# EAGLE design Motor board (EAGLE 9.4.1)
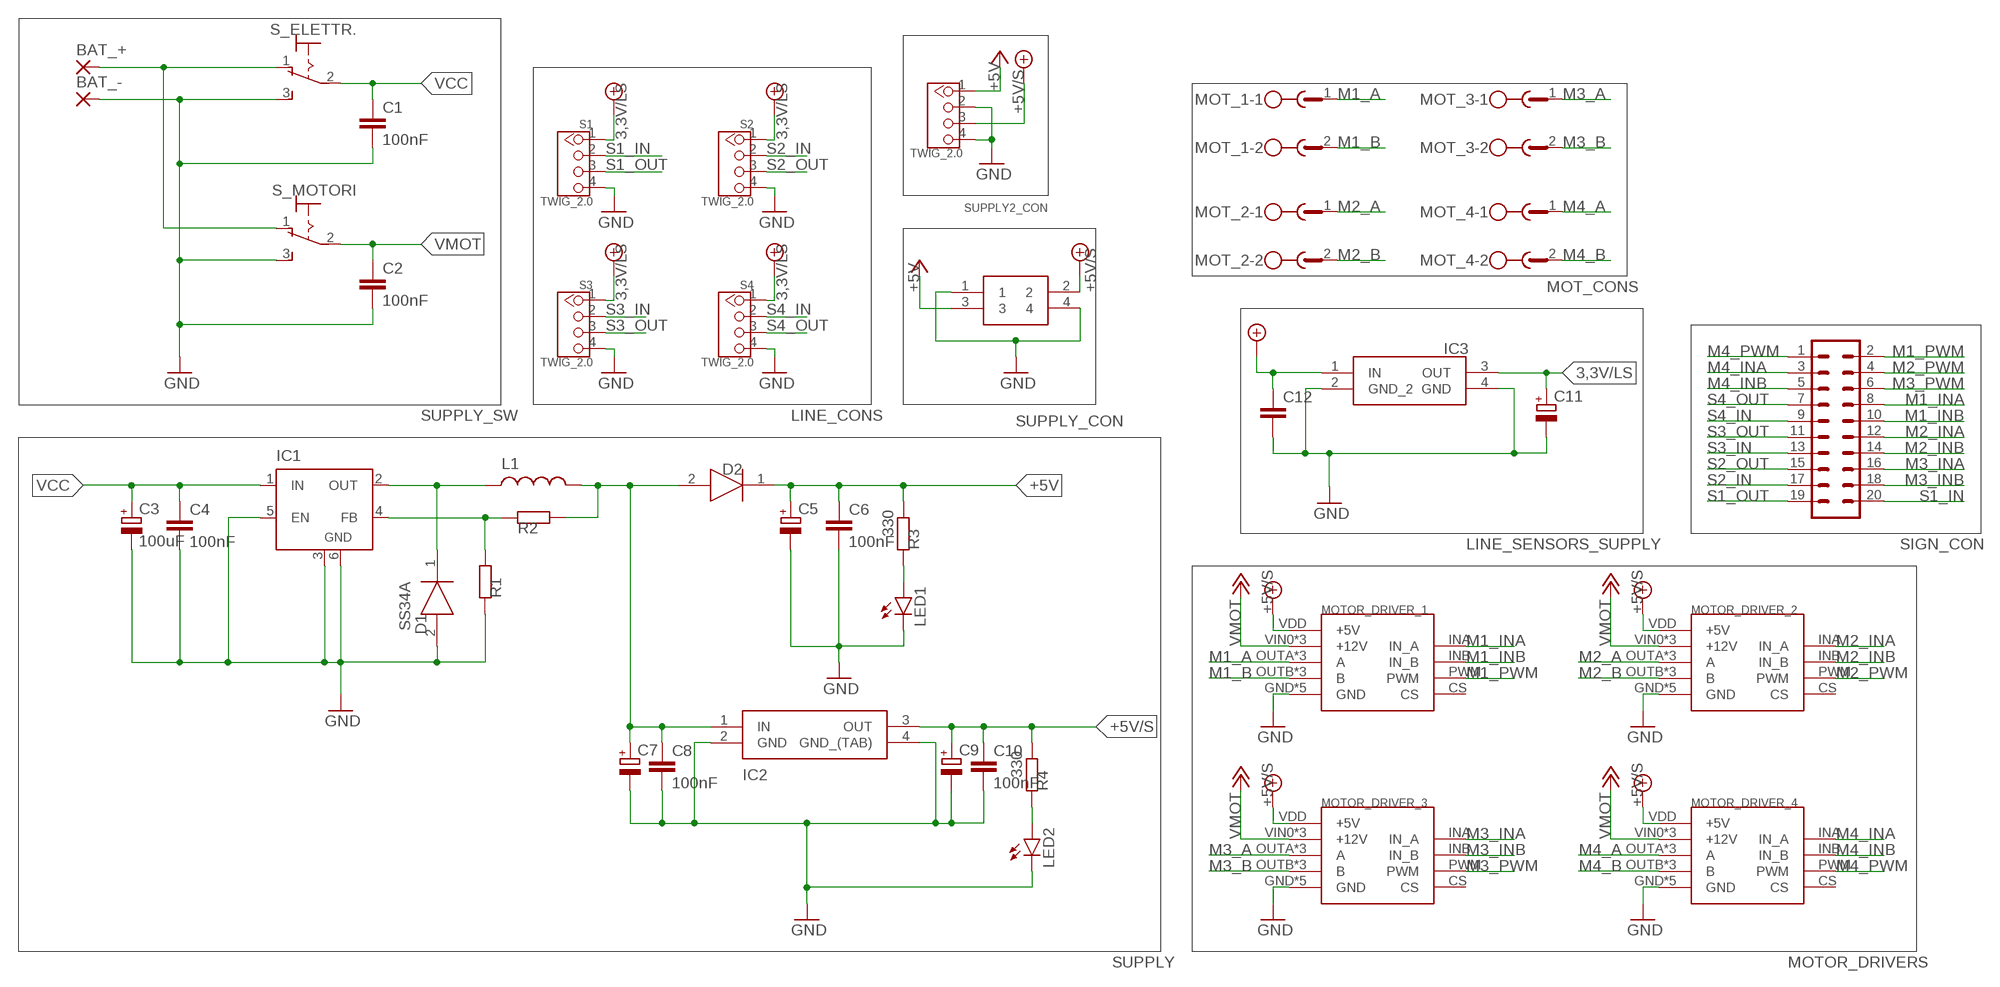
[diagram p0: schematic, sheet 1]

## Parts
BAT_+  3,81/1,4  [3,81/1,4]
BAT_-  3,81/1,4  [3,81/1,4]
C1  100nF  C-EUC1206  [C1206]
C2  100nF  C-EUC1206  [C1206]
C3  100uF  CPOL-EUCT7343  [CT7343]
C4  100nF  C-EUC1206  [C1206]
C5  CPOL-EUE  [PANASONIC_E]
C6  100nF  C-EUC1206  [C1206]
C7  CPOL-EUE  [PANASONIC_E]
C8  100nF  C-EUC1206  [C1206]
C9  CPOL-EUE  [PANASONIC_E]
C10  100nF  C-EUC1206  [C1206]
C11  CPOL-EUE  [PANASONIC_E]
C12  100nF  C-EUC1206  [C1206]
D1  SS34A  [DIOM5026X262N]
D2  SE20FG-M3_H  [SODFL3718X108N]
IC1  LM2596S  [TO263-5]
IC2  LM2940CS-5.0_NOPB  [TO254P1435X464-4N]
IC3  LM3940IS-3.3  [TO254P1435X457-4N]
L1  47uH  MSS1260  [MSS1260]
LED1  LEDSML1206  [SML1206]
LED2  LEDSML1206  [SML1206]
MOT_1  MST2V  [MSTBV2]
MOT_2  MST2V  [MSTBV2]
MOT_3  MST2V  [MSTBV2]
MOT_4  MST2V  [MSTBV2]
MOTOR_DRIVER_1  VNH5019  [VNH5019]
MOTOR_DRIVER_2  VNH5019  [VNH5019]
MOTOR_DRIVER_3  VNH5019  [VNH5019]
MOTOR_DRIVER_4  VNH5019  [VNH5019]
R1  330  R-EU_R1206  [R1206]
R2  1,2k  R-EU_R1206  [R1206]
R3  330  R-EU_R1206  [R1206]
R4  330  R-EU_R1206  [R1206]
S1  TWIG_2.0  [2.0_1X4]
S2  TWIG_2.0  [2.0_1X4]
S3  TWIG_2.0  [2.0_1X4]
S4  TWIG_2.0  [2.0_1X4]
S_ELETTR.  320-916  [320-916]
S_MOTORI  320-916  [320-916]
SIGN_CON  20V  [20V]
SUPPLY2_CON  TWIG_2.0  [2.0_1X4]
SUPPLY_CON  39-28-1043  [39-28-1043]

## Nets
3,3V/LS: C11.+ IC3.3(OUT) S1.1 S2.1 S3.1 S4.1 ; supply symbol labelled +5V/1
5.7V-DIRAMAZIONE2: C7.+ C8.1 D2.2(A) IC2.1(IN) L1.P$1 R2.1
+5V: C5.+ C6.1 D2.1(K) R3.1 SUPPLY2_CON.1 SUPPLY_CON.3
+5V/S: C9.+ C10.1 C12.1 IC2.3(OUT) IC3.1(IN) MOTOR_DRIVER_1.VDD(+5V) MOTOR_DRIVER_2.VDD(+5V) MOTOR_DRIVER_3.VDD(+5V) MOTOR_DRIVER_4.VDD(+5V) R4.1 SUPPLY2_CON.3 SUPPLY_CON.2 ; supply symbol labelled +5V/1
GND [Power]: BAT_-.1(P) C1.2 C2.2 C3.- C4.2 C5.- C6.2 C7.- C8.2 C9.- C10.2 C11.- C12.2 D1.2(A) IC1.3(GND) IC1.5(EN) IC1.6(GND) IC2.2(GND) IC2.4(GND_(TAB)) IC3.2(GND_2) IC3.4(GND) LED1.C LED2.C MOTOR_DRIVER_1.GND MOTOR_DRIVER_1.GND0(GND) MOTOR_DRIVER_1.GND1(GND) MOTOR_DRIVER_1.GND2(GND) MOTOR_DRIVER_1.GND3(GND) MOTOR_DRIVER_2.GND MOTOR_DRIVER_2.GND0(GND) MOTOR_DRIVER_2.GND1(GND) MOTOR_DRIVER_2.GND2(GND) MOTOR_DRIVER_2.GND3(GND) MOTOR_DRIVER_3.GND MOTOR_DRIVER_3.GND0(GND) MOTOR_DRIVER_3.GND1(GND) MOTOR_DRIVER_3.GND2(GND) MOTOR_DRIVER_3.GND3(GND) MOTOR_DRIVER_4.GND MOTOR_DRIVER_4.GND0(GND) MOTOR_DRIVER_4.GND1(GND) MOTOR_DRIVER_4.GND2(GND) MOTOR_DRIVER_4.GND3(GND) R1.1 S1.4 S2.4 S3.4 S4.4 S_ELETTR..3(S) S_MOTORI.3(S) SUPPLY2_CON.2 SUPPLY2_CON.4 SUPPLY_CON.1 SUPPLY_CON.4
M1_A: MOT_1.1 MOTOR_DRIVER_1.OUTA2(A) MOTOR_DRIVER_1.OUTA3(A) MOTOR_DRIVER_1.OUTA(A)
M1_B: MOT_1.2 MOTOR_DRIVER_1.OUTB1(B) MOTOR_DRIVER_1.OUTB3(B) MOTOR_DRIVER_1.OUTB(B)
M1_INA: MOTOR_DRIVER_1.INA(IN_A) SIGN_CON.8
M1_INB: MOTOR_DRIVER_1.INB(IN_B) SIGN_CON.10
M1_PWM: MOTOR_DRIVER_1.PWM SIGN_CON.2
M2_A: MOT_2.1 MOTOR_DRIVER_2.OUTA2(A) MOTOR_DRIVER_2.OUTA3(A) MOTOR_DRIVER_2.OUTA(A)
M2_B: MOT_2.2 MOTOR_DRIVER_2.OUTB1(B) MOTOR_DRIVER_2.OUTB3(B) MOTOR_DRIVER_2.OUTB(B)
M2_INA: MOTOR_DRIVER_2.INA(IN_A) SIGN_CON.12
M2_INB: MOTOR_DRIVER_2.INB(IN_B) SIGN_CON.14
M2_PWM: MOTOR_DRIVER_2.PWM SIGN_CON.4
M3_A: MOT_3.1 MOTOR_DRIVER_3.OUTA2(A) MOTOR_DRIVER_3.OUTA3(A) MOTOR_DRIVER_3.OUTA(A)
M3_B: MOT_3.2 MOTOR_DRIVER_3.OUTB1(B) MOTOR_DRIVER_3.OUTB3(B) MOTOR_DRIVER_3.OUTB(B)
M3_INA: MOTOR_DRIVER_3.INA(IN_A) SIGN_CON.16
M3_INB: MOTOR_DRIVER_3.INB(IN_B) SIGN_CON.18
M3_PWM: MOTOR_DRIVER_3.PWM SIGN_CON.6
M4_A: MOT_4.1 MOTOR_DRIVER_4.OUTA2(A) MOTOR_DRIVER_4.OUTA3(A) MOTOR_DRIVER_4.OUTA(A)
M4_B: MOT_4.2 MOTOR_DRIVER_4.OUTB1(B) MOTOR_DRIVER_4.OUTB3(B) MOTOR_DRIVER_4.OUTB(B)
M4_INA: MOTOR_DRIVER_4.INA(IN_A) SIGN_CON.3
M4_INB: MOTOR_DRIVER_4.INB(IN_B) SIGN_CON.5
M4_PWM: MOTOR_DRIVER_4.PWM SIGN_CON.1
N$1 [Power]: BAT_+.1(P) S_ELETTR..1(O) S_MOTORI.1(O)
N$2: LED2.A R4.2
N$3: LED1.A R3.2
N$6: D1.1(K) IC1.2(OUT) L1.P$2
N$7: IC1.4(FB) R1.2 R2.2
S1_IN: S1.2 SIGN_CON.20
S1_OUT: S1.3 SIGN_CON.19
S2_IN: S2.2 SIGN_CON.17
S2_OUT: S2.3 SIGN_CON.15
S3_IN: S3.2 SIGN_CON.13
S3_OUT: S3.3 SIGN_CON.11
S4_IN: S4.2 SIGN_CON.9
S4_OUT: S4.3 SIGN_CON.7
VCC: C1.1 C3.+ C4.1 IC1.1(IN) S_ELETTR..2(P)
VMOT [Power]: C2.1 MOTOR_DRIVER_1.VIN0(+12V) MOTOR_DRIVER_1.VIN1(+12V) MOTOR_DRIVER_1.VIN2(+12V) MOTOR_DRIVER_2.VIN0(+12V) MOTOR_DRIVER_2.VIN1(+12V) MOTOR_DRIVER_2.VIN2(+12V) MOTOR_DRIVER_3.VIN0(+12V) MOTOR_DRIVER_3.VIN1(+12V) MOTOR_DRIVER_3.VIN2(+12V) MOTOR_DRIVER_4.VIN0(+12V) MOTOR_DRIVER_4.VIN1(+12V) MOTOR_DRIVER_4.VIN2(+12V) S_MOTORI.2(P) ; supply symbol labelled +12V
Unconnected: MOTOR_DRIVER_1.CS MOTOR_DRIVER_2.CS MOTOR_DRIVER_3.CS MOTOR_DRIVER_4.CS

## Notes on the sheet
- MOT_CONS
- SUPPLY_SW | LINE_CONS
- LINE_SENSORS_SUPPLY
- SUPPLY | MOTOR_DRIVERS

## Library data of the parts
BAT_+ BAT_- = wirepad:3,81/1,4: THROUGH-HOLE PAD
C1 C2 C4 C6 C8 C10 C12 = rcl:C-EU: CAPACITOR, European symbol; SPICEPREFIX: C
C3 C5 C7 C9 C11 = rcl:CPOL-EU: POLARIZED CAPACITOR, European symbol; SPICEPREFIX: C
D1 = SamacSys_Parts:SS34A: HY Electronic Corp SS34A, SMT Rectifier Schottky Diode, 40V 3A, 2-Pin SMA Source: Datasheet <http://uk.rs-online.com/web/p/products/1711454>; DESCRIPTION: HY Electronic Corp SS34A, SMT Rectifier Schottky Diode, 40V 3A, 2-Pin SMA; HEIGHT: 2.62mm; MANUFACTURER_NAME: HY Electronic Corp; MANUFACTURER_PART_NUMBER: SS34A; RS_PART_NUMBER: 1711454
D2 = SE20FG-M3_H:SE20FG-M3_H: Diode Rectifier 2A 400V Standard DO219AB Vishay SE20FG-M3/H, SMT Diode, 400V 2A, 920ns, 2-Pin DO-219AB Source: Datasheet <http://uk.rs-online.com/web/p/products/8949262P>; DESCRIPTION: Diode Rectifier 2A 400V Standard DO219AB Vishay SE20FG-M3/H, SMT Diode, 400V 2A, 920ns, 2-Pin DO-219AB; HEIGHT: 1.08mm; MANUFACTURER_NAME: Vishay; MANUFACTURER_PART_NUMBER: SE20FG-M3/H; RS_PART_NUMBER: 8949262P
IC1 = linear:LM2596S: STEP-DOWN VOLTAGE REGULATOR
IC2 = LM2940CS-5.0_NOPB:LM2940CS-5.0_NOPB: 1A,5V,LDO Voltage Regulator,LM2940CS-5.0 Source: Datasheet <http://www.ti.com/lit/ds/symlink/lm2940c.pdf>; DESCRIPTION: 1A,5V,LDO Voltage Regulator,LM2940CS-5.0; HEIGHT: 4.64mm; MANUFACTURER_NAME: Texas Instruments; MANUFACTURER_PART_NUMBER: LM2940CS-5.0/NOPB; MOUSER_PART_NUMBER: 926-LM2940CS-5.0NOPB; MOUSER_PRICE-STOCK: https://www.mouser.com/Search/Refine.aspx?Keyword=926-LM2940CS-5.0NOPB; RS_PART_NUMBER: 2508123693; RS_PRICE-STOCK: http://uk.rs-online.com/web/p/products/2508123693
IC3 = LM3940IS-3.3:LM3940IS-3.3: Low Dropout Regulator Source: Datasheet; DESCRIPTION: Low Dropout Regulator; HEIGHT: mm; MANUFACTURER_NAME: Texas Instruments; MANUFACTURER_PART_NUMBER: LM3940IS-3.3; MOUSER_PART_NUMBER: 926-LM3940IS-33; MOUSER_PRICE-STOCK: https://www.mouser.com/Search/Refine.aspx?Keyword=926-LM3940IS-33; RS_PART_NUMBER: 3461773; RS_PRICE-STOCK: http://uk.rs-online.com/web/p/products/3461773
L1 = inductor-coilcraft:MSS1260: SMT Power Inductor
LED1 LED2 = led:LED: LED OSRAM: - CHIPLED LG R971, LG N971, LY N971, LG Q971, LY Q971, LO R971, LY R971 LH N974, LH R974 LS Q976, LO Q976, LY Q976 LO Q996 - Hyper CHIPLED LW Q18S LB Q993, LB Q99A, LB R99A - SideLED LS A670, LO A670, LY A670, LG A670, LP A670 LB A673, LV A673, LT A673, LW A673 LH A674 LY A675 LS A676, LA A676, LO A676, LY A676, LW A676 LS A679, LY A679, LG A679 - Hyper Micro SIDELED® LS Y876, LA Y876, LO Y876, LY Y876 LT Y87S - SmartLED LW L88C, LW L88S LB L89C, LB L89S, LG L890 LS L89K, LO L89K, LY L89K LS L896, LA L896, LO L896, LY L896 - TOPLED LS T670, LO T670, LY T670, LG T670, LP T670 LSG T670, LSP T670, LSY T670, LOP T670, LYG T670 LG T671, LOG T671, LSG T671 LB T673, LV T673, LT T673, LW T673 LH T674 LS T676, LA T676, LO T676, LY T676, LB T676, LH T676, LSB T676, LW T676 LB T67C, LV T67C, LT T67C, LS T67K, LO T67K, LY T67K, LW E67C LS E67B, LA E67B, LO E67B, LY E67B, LB E67C, LV E67C, LT E67C LW T67C LS T679, LY T679, LG T679 LS T770, LO T770, LY T770, LG T770, LP T770 LB T773, LV T773, LT T773, LW T773 LH T774 LS E675, LA E675, LY E675, LS T675 LS T776, LA T776, LO T776, LY T776, LB T776 LHGB T686 LT T68C, LB T68C - Hyper Mini TOPLED® LB M676 - Mini TOPLED Santana® LG M470 LS M47K, LO M47K, LY M47K Source: http://www.osram.convergy.de LUXEON: - LUMILED® LXK2-PW12-R00, LXK2-PW12-S00, LXK2-PW14-U00, LXK2-PW14-V00 LXK2-PM12-R00, LXK2-PM12-S00, LXK2-PM14-U00 LXK2-PE12-Q00, LXK2-PE12-R00, LXK2-PE12-S00, LXK2-PE14-T00, LXK2-PE14-U00 LXK2-PB12-K00, LXK2-PB12-L00, LXK2-PB12-M00, LXK2-PB14-N00, LXK2-PB14-P00, LXK2-PB14-Q00 LXK2-PR12-L00, LXK2-PR12-M00, LXK2-PR14-Q00, LXK2-PR14-R00 LXK2-PD12-Q00, LXK2-PD12-R00, LXK2-PD12-S00 LXK2-PH12-R00, LXK2-PH12-S00 LXK2-PL12-P00, LXK2-PL12-Q00, LXK2-PL12-R00 Source: www.luxeon.com KINGBRIGHT: KA-3528ASYC Source: www.kingbright.com
MOT_1-MOT_4 = con-phoenix-508:MST2V: PHOENIX; OC_FARNELL: unknown; OC_NEWARK: unknown
MOTOR_DRIVER_1-MOTOR_DRIVER_4 = DRIVER POLOLU:VNH5019: aggiornato il 24/10/14 con pin cs (AD)
R1-R4 = rcl:R-EU_: RESISTOR, European symbol; SPICEPREFIX: R
S1-S4 SUPPLY2_CON = CONNECTER:TWIG_2.0
S_ELETTR. S_MOTORI = switch:320-916: TOGGLE SWITCH distributor RS Components
SIGN_CON = con-harting-v-edit:20V: CONNECTOR; OC_FARNELL: unknown; OC_NEWARK: unknown
SUPPLY_CON = 39-28-1043:39-28-1043: Mini-Fit Jr. Vertical Header, 4.20mm Pitch, Dual Row, 4 Circuits, without Snap-in Plastic Peg PCB Lock, Tin, Natural Source: Datasheet <http://docs-emea.rs-online.com/webdocs/0460/0900766b80460da1.pdf>; DESCRIPTION: Mini-Fit Jr. Vertical Header, 4.20mm Pitch, Dual Row, 4 Circuits, without Snap-in Plastic Peg PCB Lock, Tin, Natural; HEIGHT: mm; MANUFACTURER_NAME: Molex; MANUFACTURER_PART_NUMBER: 39-28-1043; MOUSER_PART_NUMBER: 538-39-28-1043; MOUSER_PRICE-STOCK: https://www.mouser.com/Search/Refine.aspx?Keyword=538-39-28-1043; RS_PART_NUMBER: 4841899P; RS_PRICE-STOCK: http://uk.rs-online.com/web/p/products/4841899P

## Net classes
1 Power: width 0.508 mm, clearance 0.508 mm

## Board
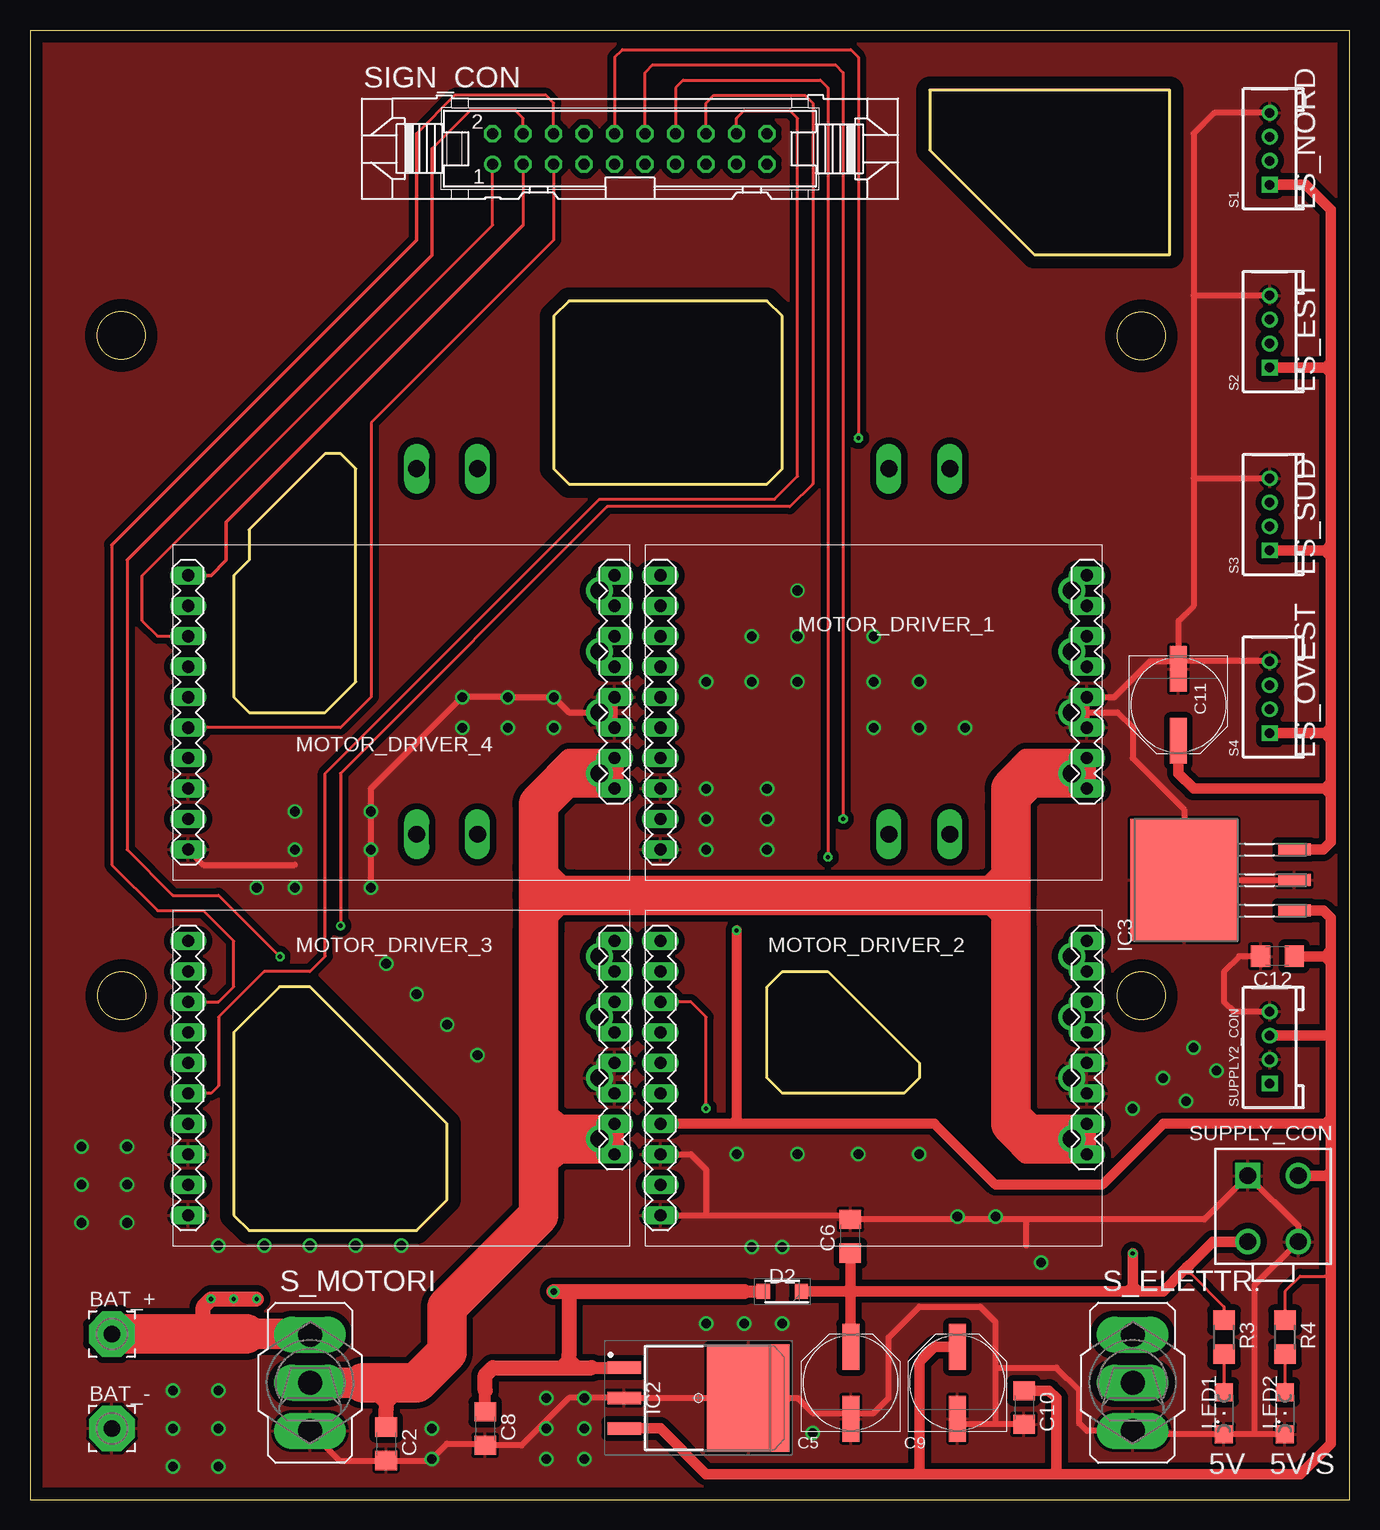
[diagram p1: board, top side]
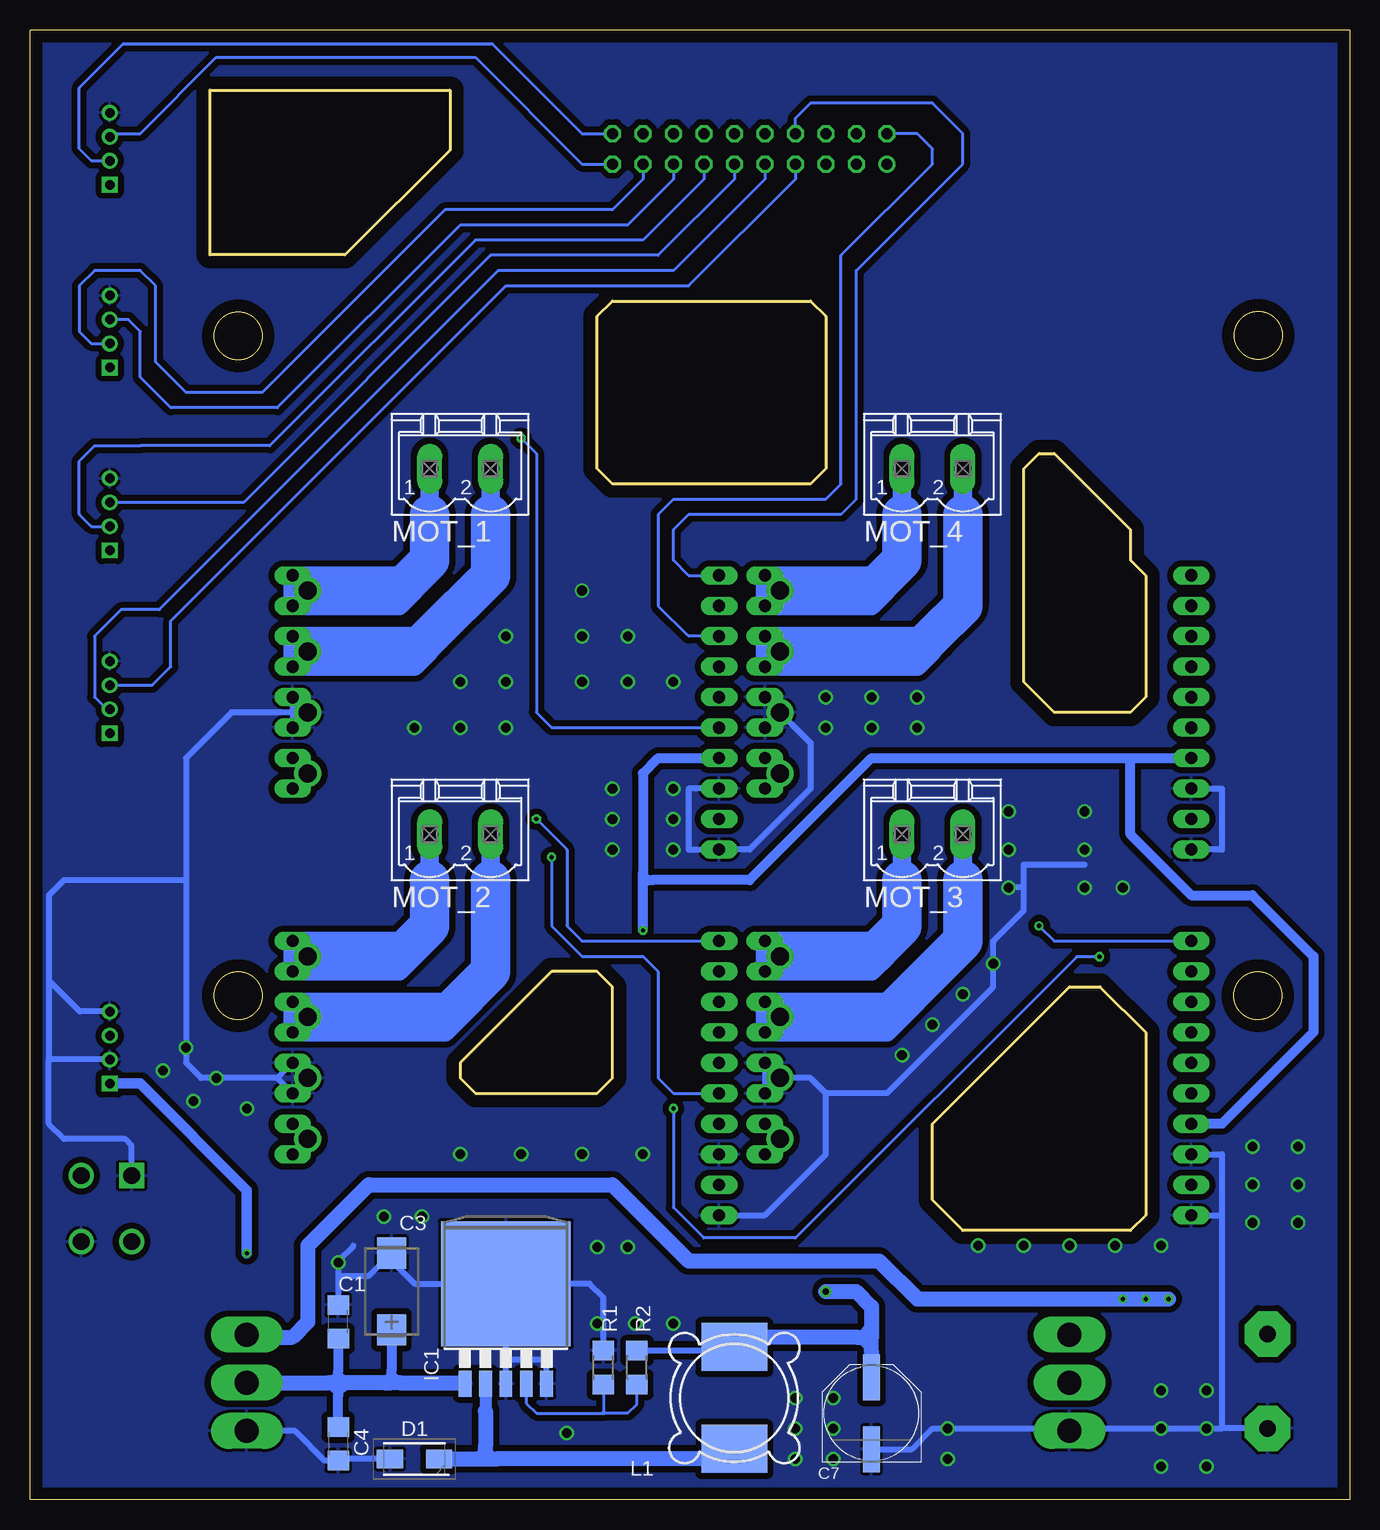
[diagram p2: board, bottom side, seen from below]

Size 110 x 122.5 mm. Coordinates in mm from the lower left corner, seen from the top.
Outline: 110,0 110,122.5 0,122.5 0,0 110,0
Outline: 75,112.5 83.73,103.77 95,103.77 95,117.5 75,117.5 75,112.5
Outline: 43.66,85.93 44.93,84.66 61.44,84.66 62.71,85.93 62.71,98.63 61.44,99.9 44.93,99.9 43.66,98.63 43.66,85.93
Outline: 16.99,38.94 16.99,23.7 18.26,22.43 32.23,22.43 34.77,24.97 34.77,31.32 23.34,42.75 20.8,42.75 16.99,38.94
Outline: 61.44,42.75 62.71,44.02 66.52,44.02 74.14,36.4 74.14,35.13 72.87,33.86 62.71,33.86 61.44,35.13 61.44,42.75
Outline: 18.26,65.61 24.61,65.61 27.15,68.15 27.15,85.93 25.88,87.2 24.61,87.2 18.26,80.85 18.26,78.31 16.99,77.04 16.99,66.88 18.26,65.61
Outline: circle at 7.64,42.01 radius 2
Outline: circle at 7.6,97.05 radius 2
Outline: circle at 92.64,97.01 radius 2
Outline: circle at 92.64,42.01 radius 2
Copper layers (1*16): Top 0.035mm / dielectric 1.5mm / Bottom 0.035mm
Design rules "default *": minimum track width 6mil, minimum drill 0.35mm, track to track 5mil, track to pad 7mil, pad to pad 10mil, via to via 10mil, smd to smd 6mil, copper to edge 40mil, drill to drill 6mil, minimum pad ring 10mil, minimum via ring 8mil, stop-mask expansion 4mil, vias tented up to drill 0mil, thermal gap 10mil

### Footprints (pad centres in the part's own frame; a part is rotated, then mirrored left to right if it is on the bottom)
3,81/1,4 = drill 1.397 pad 3.81 octagon: 1 0,0
C1206 = smd 1.6 x 1.8: 1 -1.4,0; 2 1.4,0
CT7343 = smd 2.6 x 2.4: + -3.2,0; - 3.2,0
PANASONIC_E = smd 3.8 x 1.4: + 3,0; - -3,0
DIOM5026X262N = smd 2.2 x 1.55: 1 -2.05,0; 2 2.05,0
SODFL3718X108N = smd 1.12 x 1.22: 1 -1.6,0; 2 1.6,0
TO263-5 = smd 1.067 x 2.159: 1 -3.404,-5.791; 2 -1.702,-5.791; 3 0,-5.791; 4 1.702,-5.791; 5 3.404,-5.791 | smd 10.8 x 10.41: 6 0,2.54
TO254P1435X464-4N = smd 2.8 x 1.05: 1 -6.2,2.54; 2 -6.2,0; 3 -6.2,-2.54 | smd 6.85 x 8.95: 4 4.15,0
TO254P1435X457-4N = smd 1.016 x 2.692: 1 -2.54,-9.042; 2 0,-9.042; 3 2.54,-9.042 | smd 10.16 x 8.941: 4 0,0.152
MSS1260 = smd 5.5 x 4: P$1 0,4.25; P$2 0,-4.25
SML1206 = smd 1.5 x 1.5: A 1.75,0; C -1.75,0
MSTBV2 = drill 1.397 long: 1 -2.54,0; 2 2.54,0
VNH5019 = drill 1.016 long: CS 1.27,17.78; ENA 1.27,22.86; ENB 1.27,15.24; GND 1.27,7.62; GND0 36.83,12.7; GND1 1.27,2.54; GND2 36.83,15.24; INA 1.27,25.4; INB 1.27,12.7; OUTA 36.83,22.86; OUTA2 36.83,25.4; OUTB 36.83,17.78; OUTB1 36.83,20.32; PWM 1.27,20.32; VDD 1.27,10.16; VIN0 36.83,7.62; VIN1 36.83,10.16; VOUT 1.27,5.08 | drill 1.5: GND3 35.56,13.97; OUTA3 35.56,24.13; OUTB3 35.56,19.05; VIN2 35.56,8.89
R1206 = smd 1.6 x 1.803: 1 -1.422,0; 2 1.422,0
2.0_1X4 = drill 0.8 pad 1.27 square: 1 -3,0 | drill 0.8 pad 1.27: 2 -1,0; 3 1,0; 4 3,0
320-916 = drill 2.007 long: 1 0,4.013; 2 0,0; 3 0,-4.013
20V = drill 0.914: 1 -11.43,-1.27 | drill 0.914 octagon: 2 -11.43,1.27; 3 -8.89,-1.27; 4 -8.89,1.27; 5 -6.35,-1.27; 6 -6.35,1.27; 7 -3.81,-1.27; 8 -3.81,1.27; 9 -1.27,-1.27; 10 -1.27,1.27; 11 1.27,-1.27; 12 1.27,1.27; 13 3.81,-1.27; 14 3.81,1.27; 15 6.35,-1.27; 16 6.35,1.27; 17 8.89,-1.27; 18 8.89,1.27; 19 11.43,-1.27; 20 11.43,1.27
39-28-1043 = drill 1.4 pad 2.1 square: 1 -2.1,7.35 | drill 1.4 pad 2.1: 2 2.1,7.35; 3 -2.1,1.85; 4 2.1,1.85

### Placement (x,y rotation side)
BAT_+  6.83,13.79 0 top
BAT_-  6.83,5.92 0 top
C1  84.3,14.81 90 bottom
C2  29.69,4.65 270 top
C3  79.86,17.35 90 bottom
C4  84.3,4.65 270 bottom
C5  68.42,9.73 90 top
C6  68.38,21.95 90 top
C7  39.85,7.19 90 bottom
C8  37.94,5.92 270 top
C9  77.31,9.73 90 top
C10  82.87,7.67 270 top
C11  95.73,66.25 270 top
C12  103.99,45.29 180 top
D1  77.95,3.38 180 bottom
D2  62.71,17.35 180 top
IC1  70.33,15.44 0 bottom
IC2  55.72,8.46 0 top
IC3  96.36,51.64 90 top
L1  51.28,8.46 0 bottom
LED1  99.54,7.19 90 top
LED2  104.62,7.19 90 top
MOT_1  74.14,85.93 0 bottom
MOT_2  74.14,55.45 0 bottom
MOT_3  34.77,55.45 0 bottom
MOT_4  34.77,85.93 0 bottom
MOTOR_DRIVER_1  51.28,51.64 0 top
MOTOR_DRIVER_2  51.28,21.16 0 top
MOTOR_DRIVER_3  11.91,21.16 0 top
MOTOR_DRIVER_4  11.91,51.64 0 top
R1  62.2,11 270 bottom
R2  59.41,11 270 bottom
R3  99.54,13.54 270 top
R4  104.62,13.54 270 top
S1  103.35,112.6 90 top
S2  103.35,97.36 90 top
S3  103.35,82.12 90 top
S4  103.35,66.88 90 top
S_ELETTR.  91.92,9.73 0 top
S_MOTORI  23.34,9.73 0 top
SIGN_CON  50.01,112.6 0 top
SUPPLY2_CON  103.35,37.67 90 top
SUPPLY_CON  103.63,19.65 0 top

### Tracks (layer width: path | path; a pad name or v marks a point on that pad's centre or on a via)
3,3V/LS
  Top 0.508: 108.43,64.59 107.72,63.88 107.67,63.88 108.22,63.32 108.43,63.32 | 108.43,79.83 107.72,79.12 107.67,79.12 108.43,78.36 108.43,78.31 | 107.67,94.36 107.72,94.36 | 107.72,94.36 108.43,95.07 108.43,95.33 | 107.72,94.36 108.43,93.65 108.43,93.55
  Top 0.889: S1.1 106.35,109.6 108.43,107.52 108.43,95.33 108.43,94.19 | 108.43,63.7 108.43,63.32 108.43,59.77 | 108.43,63.7 108.43,64.59 108.43,78.31 108.43,78.94 | 108.43,78.94 108.43,79.83 108.43,93.55 108.43,94.19 | S2.1 107.67,94.36 108.25,94.36 108.43,94.19 | S3.1 107.67,79.12 108.25,79.12 108.43,78.94 | S4.1 107.67,63.88 108.25,63.88 108.43,63.7 | IC3.3 107.79,54.18 108.43,54.81 108.43,58.75 | 108.43,58.75 108.43,59.26 | 108.43,59.26 108.43,59.77 | C11.+ 95.73,60.53 97,59.26 107.92,59.26 | 108.43,59.26 107.92,59.26 | 108.43,59.77 107.92,59.26 | 107.92,59.26 108.43,58.75
5.7V-DIRAMAZIONE2  (via drill 0.55)
  Top 0.305: 44.17,11.51 44.68,12.02 44.93,12.02 45.18,12.02 45.69,11.51
  Top 1.016: 46.83,11 IC2.1 | C8.1 37.94,9.09 | 59.53,17.35 D2.2
  Top 1.27: v43.66,17.35 44.93,17.35 | 44.93,17.35 44.93,12.02 44.93,11 | 44.93,11 46.83,11 | 37.94,9.09 37.94,10.37 38.58,11 44.93,11 | 44.93,17.35 59.53,17.35
  Bottom 0.406: 39.85,12.27 41.12,13.54 39.85,14.81
  Bottom 0.508: R2.1 51.64,12.42 51.28,12.78
  Bottom 1.016: C7.+ 39.85,12.27
  Bottom 1.27: v43.66,17.35 41.12,17.35 39.85,16.08 39.85,14.81 39.85,13.54 | 39.85,13.54 41.12,13.54 50.52,13.54 51.28,12.78 L1.P$1 | 39.85,12.27 39.85,13.54
+5V  (via drill 0.35)
  Top 0.152: 96.11,19 96.3,18.81 96.81,18.81 96.81,19.44 96.68,19.57
  Top 0.254: 96.36,19.25 96.81,18.81 99.54,16.08 R3.1
  Top 0.305: 67.62,17.35 68.38,16.59 69.06,17.27 69.06,17.35 69.06,17.43 68.38,18.11 67.62,17.35 | 67.62,17.35 67.54,17.35
  Top 0.406: 91.16,17.35 91.92,18.11 92.68,17.35
  Top 0.813: 68.38,12.73 C5.+
  Top 0.889: C6.1 68.38,18.11 68.38,17.35 | 68.38,17.35 68.38,16.59 68.38,12.73 | D2.1 67.54,17.35 68.38,17.35 | 91.92,17.35 92.68,17.35 94.46,17.35 96.11,19 96.36,19.25 96.68,19.57 98.61,21.5 SUPPLY_CON.3 | 91.92,17.35 91.16,17.35 69.06,17.35 68.38,17.35 | v91.92,20.53 91.92,18.11 91.92,17.35
  Bottom 0.889: SUPPLY2_CON.1 100.81,34.67 91.92,25.78 v91.92,20.53
+5V/S  (via drill 0.35)
  Top 0.152: 108.43,18.24 108.3,18.24 107.92,18.62 108.43,19.13
  Top 0.254: 108.43,18.62 107.92,18.62 105.89,18.62 104.62,17.35 R4.1
  Top 0.305: 73.38,2.11 74.14,2.87 74.9,2.11 | 84.81,2.11 85.57,2.87 86.33,2.11 | 108.43,27.76 107.67,27 108.17,26.49 108.43,26.49 | 58.14,31.32 58.65,31.83 58.9,31.83 59.15,31.83 59.66,31.32
  Top 0.406: 108.43,32.08 107.67,31.32 108.18,30.81 108.43,30.81
  Top 0.813: 108.43,31.32 107.67,31.32 94.46,31.32 89.38,26.24 80.49,26.24 75.41,31.32 59.66,31.32 58.9,31.32 | 58.9,31.32 58.14,31.32 MOTOR_DRIVER_2.VDD | 58.9,31.32 58.9,31.83 v58.9,47.45
  Top 0.889: IC2.3 52.55,5.92 56.36,2.11 73.38,2.11 74.14,2.11 | C9.+ 75.41,12.73 74.14,11.46 74.14,2.87 74.14,2.11 | 74.14,2.11 74.9,2.11 84.81,2.11 85.57,2.11 | C10.1 84.96,9.07 85.57,8.46 85.57,2.87 85.57,2.11 | 85.57,2.11 86.33,2.11 105.89,2.11 108.43,4.65 108.43,18.24 108.43,18.62 108.43,19.13 108.43,26.49 108.43,27 | SUPPLY_CON.2 107.67,27 108.43,27 | 108.43,27 108.43,27.76 108.43,30.81 108.43,31.32 108.43,32.08 108.43,38.94 | IC3.1 107.79,49.1 108.43,48.47 108.43,45.8 | 108.43,45.8 108.43,45.29 | 108.43,45.29 108.43,44.78 | 108.43,44.78 108.43,38.94 | 108.43,38.94 108.16,38.67 SUPPLY2_CON.3 | C12.1 107.92,45.29 | 107.92,45.29 108.43,45.29 | 108.43,45.8 107.92,45.29 | 107.92,45.29 108.43,44.78
  Bottom 0.305: 58.9,52.15 58.65,52.15 58.14,51.64 58.65,51.13 58.9,51.13
  Bottom 0.813: MOTOR_DRIVER_1.VDD 57.63,61.8 58.9,60.53 58.9,52.15 58.9,51.64 | 18.26,61.8 39.85,61.8 50.01,51.64 58.14,51.64 58.9,51.64 | 18.26,61.8 MOTOR_DRIVER_4.VDD | 18.26,61.8 18.26,55.45 13.18,50.37 8.1,50.37 3.02,45.29 3.02,38.94 10.64,31.32 MOTOR_DRIVER_3.VDD | v58.9,47.45 58.9,51.13 58.9,51.64
GND  (via drill 0.8)
  Top 0.508: S_MOTORI.3 25.81,3.25 C2.2 33.37,3.25 34.77,4.65 37.81,4.65 C8.2 40.99,4.52 44.93,8.46 IC2.2 IC2.4 63.98,8.46 65.25,7.19 67.97,7.19 C5.- 68.89,7.19 70.33,7.19 71.6,8.46 71.6,13.54 74.14,16.08 79.22,16.08 80.49,14.81 80.49,11 | 80.49,11 85.57,11 87.47,9.09 87.47,6.35 88.11,5.72 S_ELETTR..3 92.2,5.44 LED1.C 102.08,5.44 | LED2.C 102.08,5.44 | 102.08,5.44 102.08,17.85 SUPPLY_CON.4 105.73,22.8 SUPPLY_CON.1 97.88,23.35 83.03,23.35 | 83.03,23.35 C6.2 68.03,23.7 56.36,23.7 | MOTOR_DRIVER_2.GND1 56.36,23.7 | MOTOR_DRIVER_2.GND 55.09,28.78 56.36,27.51 56.36,23.7 | 83.03,23.35 83.03,21.16 | S1.4 98.73,115.6 97,113.87 97,100.36 | MOTOR_DRIVER_4.GND1 14.45,52.91 22.07,52.91 | MOTOR_DRIVER_4.GND3 MOTOR_DRIVER_4.GND2 MOTOR_DRIVER_4.GND0 MOTOR_DRIVER_4.GND3 | C10.2 80.49,6.27 | 80.49,6.27 77.77,6.27 C9.- | 80.49,11 80.49,6.27 | v28.42,51 v28.42,54.18 v28.42,57.36 28.42,59.26 v36.04,66.88 v39.85,66.88 v43.66,66.88 44.93,65.61 MOTOR_DRIVER_4.GND3 | 97,52.91 98.27,51.64 IC3.2 | S2.4 97,100.36 | S3.4 97,85.12 | S4.4 95.78,69.88 | MOTOR_DRIVER_1.GND3 MOTOR_DRIVER_1.GND2 | MOTOR_DRIVER_1.GND2 MOTOR_DRIVER_1.GND0 MOTOR_DRIVER_1.GND3 | MOTOR_DRIVER_1.GND2 90.4,66.88 93.4,69.88 95.78,69.88 | MOTOR_DRIVER_1.GND3 90.65,65.61 91.92,64.34 91.92,61.8 96.21,57.51 IC3.4 | C12.2 100.81,45.29 99.54,44.02 99.54,41.48 100.35,40.67 SUPPLY2_CON.4 | 95.78,69.88 95.73,69.93 95.73,73.23 97,74.5 97,85.12 | 97,100.36 97,85.12
  Bottom 0.508: BAT_-.1 10.64,5.92 | 10.64,5.92 23.14,5.92 S_MOTORI.3 23.54,5.92 34.77,5.92 36.5,4.19 C7.- | 83.03,21.16 84.3,19.89 84.3,18.62 | 84.3,18.62 C1.2 | 84.3,18.62 81.78,18.62 C3.- 79.86,19.89 77.95,17.98 IC1.6 | 89.38,35.13 MOTOR_DRIVER_2.GND0 MOTOR_DRIVER_2.GND3 MOTOR_DRIVER_2.GND2 89.38,35.13 | MOTOR_DRIVER_1.GND2 88.11,65.61 | 88.11,65.61 MOTOR_DRIVER_1.GND0 | 88.11,65.61 93.19,65.61 97,61.8 97,51.64 | MOTOR_DRIVER_2.GND1 48.74,23.7 43.66,28.78 43.66,33.86 | 43.66,33.86 44.93,35.13 MOTOR_DRIVER_3.GND3 | MOTOR_DRIVER_3.GND3 MOTOR_DRIVER_3.GND0 MOTOR_DRIVER_3.GND2 MOTOR_DRIVER_3.GND3 | MOTOR_DRIVER_3.GND1 10.64,23.7 | 10.64,23.7 10.64,5.92 | MOTOR_DRIVER_3.GND 10.64,28.78 10.64,23.7 | MOTOR_DRIVER_4.GND 10.64,59.26 10.64,54.18 MOTOR_DRIVER_4.GND1 | 43.66,33.86 38.58,33.86 29.69,42.75 29.69,46.56 27.15,49.1 27.15,51 | MOTOR_DRIVER_4.GND3 44.93,63.07 44.93,59.26 50.01,54.18 MOTOR_DRIVER_1.GND1 55.09,54.18 55.09,59.26 MOTOR_DRIVER_1.GND | D1.2 84.17,3.38 C4.2 85.44,3.25 87.91,5.72 S_ELETTR..3 | IC1.3 70.33,11.64 | 70.33,11.64 IC1.6 | 70.33,20.4 IC1.6 | IC1.5 66.93,11.41 67.16,11.64 70.33,11.64 | R1.1 62.2,16.84 63.34,17.98 IC1.6 | SUPPLY_CON.1 101.53,29.5 102.08,30.05 107.16,30.05 108.43,31.32 108.43,36.67 | 89.38,35.13 95.73,35.13 97,36.4 97,51.64 | 108.43,43.26 108.43,50.37 107.16,51.64 97,51.64 | SUPPLY2_CON.4 105.84,40.67 108.43,43.26 | 22.07,52.91 27.15,52.91 27.15,51 | 27.15,51 v28.42,51 | 108.43,43.26 108.43,36.67 | SUPPLY2_CON.2 108.43,36.67
  other vias: 36.04,64.34 39.85,64.34 60.17,71.96 56.36,68.15 63.98,68.15 60.17,68.15 63.98,75.77 63.98,71.96 77.95,64.34 74.14,64.34 70.33,64.34 70.33,68.15 70.33,71.96 74.14,68.15 43.66,64.34 56.36,59.26 56.36,54.18 56.36,56.72 61.44,59.26 61.44,56.72 61.44,54.18 22.07,51 22.07,54.18 22.07,57.36 18.9,51 8.1,26.24 8.1,29.42 8.1,23.06 11.91,5.92 11.91,9.09 11.91,2.74 15.72,5.92 15.72,9.09 15.72,2.74 4.29,26.24 4.29,29.42 4.29,23.06 33.5,5.92 33.5,3.38 43.03,3.38 46.2,3.38 46.2,5.92 46.2,8.46 43.03,8.46 43.03,5.92 65.25,5.54 62.71,14.68 59.53,14.68 56.36,14.68 62.71,21.03 60.17,21.03 84.3,19.76 77.31,23.57 80.49,23.57 37.31,37.03 34.77,39.58 32.23,42.11 29.69,44.66 58.9,28.78 63.98,28.78 69.06,28.78 74.14,28.78 91.92,32.59 94.46,35.13 97,37.67 96.36,33.22 98.91,35.77 30.96,21.16 27.15,21.16 23.34,21.16 19.53,21.16 15.72,21.16
  pour Top (isolate 0.508): -2.06,124.03 110.97,124.03 110.97,-1.7 -2.06,-1.7
  pour Bottom (isolate 0.508): -0.79,125.3 112.24,125.3 112.24,-0.43 -0.79,-0.43
M1_A
  Bottom 1.524: 76.68,82.12 MOT_1.1 | MOTOR_DRIVER_1.OUTA3 84.3,75.77 | 76.68,78.31 77.95,77.04 MOTOR_DRIVER_1.OUTA2 MOTOR_DRIVER_1.OUTA 79.22,74.5 77.95,75.77
  Bottom 3.302: 84.3,75.77 79.22,75.77 76.68,78.31 76.68,82.12
M1_B
  Bottom 1.524: MOT_1.2 71.6,82.12 | 83.03,70.69 MOTOR_DRIVER_1.OUTB3 | 76.68,71.96 MOTOR_DRIVER_1.OUTB1 MOTOR_DRIVER_1.OUTB 77.95,69.42 76.68,70.69
  Bottom 3.302: 71.6,82.12 71.6,77.04 76.68,71.96 77.95,70.69 83.03,70.69
M1_INA
  Bottom 0.254: SIGN_CON.8 46.2,115.14 44.93,116.41 34.77,116.41 32.23,113.87 32.23,111.33 41.12,102.44 41.12,83.39 42.39,82.12 55.09,82.12 56.36,80.85 56.36,78.31 55.09,77.04 MOTOR_DRIVER_1.INA
M1_INB  (via drill 0.35)
  Top 0.254: SIGN_CON.10 48.74,120.22 49.38,120.85 68.42,120.85 69.06,120.22 v69.06,88.47
  Bottom 0.254: MOTOR_DRIVER_1.INB 66.52,64.34 67.79,65.61 67.79,87.2 v69.06,88.47
M1_PWM
  Bottom 0.254: MOTOR_DRIVER_1.PWM 55.09,71.96 57.63,74.5 57.63,82.12 56.36,83.39 43.66,83.39 42.39,84.66 42.39,103.71 34.77,111.33 34.77,112.6 36.04,113.87 SIGN_CON.2
M2_A
  Bottom 1.524: MOTOR_DRIVER_2.OUTA3 84.3,45.29 | 76.68,47.83 77.95,46.56 MOTOR_DRIVER_2.OUTA2 MOTOR_DRIVER_2.OUTA 79.22,44.02 76.68,46.56 | MOT_2.1 76.68,51.64
  Bottom 3.302: 84.3,45.29 79.22,45.29 76.68,47.83 76.68,51.64
M2_B
  Bottom 1.524: MOTOR_DRIVER_2.OUTB3 84.3,40.21 | MOT_2.2 71.6,51.64 | 74.01,41.61 74.14,41.48 MOTOR_DRIVER_2.OUTB1 MOTOR_DRIVER_2.OUTB 75.41,38.94 72.87,41.48
  Bottom 3.302: 84.3,40.21 75.41,40.21 74.01,41.61 71.6,44.02 71.6,51.64
M2_INA  (via drill 0.35)
  Top 0.254: SIGN_CON.12 51.28,118.95 51.92,119.59 67.16,119.59 67.79,118.95 v67.79,56.72
  Bottom 0.254: v67.79,56.72 65.25,54.18 65.25,47.83 63.98,46.56 MOTOR_DRIVER_2.INA
M2_INB  (via drill 0.35)
  Top 0.254: SIGN_CON.14 53.82,117.68 54.45,118.31 65.89,118.31 66.52,117.68 v66.52,53.55
  Bottom 0.254: v66.52,53.55 66.52,47.83 63.98,45.29 58.9,45.29 57.63,44.02 57.63,35.13 56.36,33.86 MOTOR_DRIVER_2.INB
M2_PWM  (via drill 0.35)
  Top 0.254: SIGN_CON.4 41.12,115.14 40.48,115.78 36.67,115.78 33.5,112.6 | v56.36,32.59 56.36,40.21 55.09,41.48 MOTOR_DRIVER_2.PWM | 8.1,78.31 8.1,54.18 11.91,50.37 15.72,50.37 v20.84,45.25
  Top 0.305: 33.5,112.6 33.5,103.71 8.1,78.31
  Bottom 0.254: v56.36,32.59 56.36,24.33 53.82,21.8 46.2,21.8 22.74,45.25 v20.84,45.25
M3_A
  Bottom 1.524: 44.93,45.29 MOTOR_DRIVER_3.OUTA3 | MOT_3.1 37.31,51.64 | 37.31,47.83 38.58,46.56 MOTOR_DRIVER_3.OUTA2 MOTOR_DRIVER_3.OUTA 39.85,44.02 38.58,45.29
  Bottom 3.302: 37.31,51.64 37.31,47.83 39.85,45.29 44.93,45.29
M3_B
  Bottom 1.524: 44.93,40.21 MOTOR_DRIVER_3.OUTB3 | MOT_3.2 32.23,51.64 | 37.31,41.48 MOTOR_DRIVER_3.OUTB1 MOTOR_DRIVER_3.OUTB 38.58,38.94 36.04,41.48
  Bottom 3.302: 32.23,51.64 32.23,46.56 37.31,41.48 38.58,40.21 44.93,40.21
M3_INA  (via drill 0.35)
  Top 0.254: SIGN_CON.16 56.36,116.41 57,117.04 64.61,117.04 65.25,116.41 65.25,84.66 63.34,82.75 48.11,82.75 25.88,60.53 v25.88,47.83
  Bottom 0.254: MOTOR_DRIVER_3.INA 24.61,46.56 v25.88,47.83
M3_INB
  Top 0.254: SIGN_CON.18 58.9,115.14 59.53,115.78 63.34,115.78 63.98,115.14 63.98,85.29 62.08,83.39 47.47,83.39 24.61,60.53 24.61,45.29 23.34,44.02 19.53,44.02 15.72,40.21 15.72,34.5 15.09,33.86 MOTOR_DRIVER_3.INB
M3_PWM
  Top 0.254: MOTOR_DRIVER_3.PWM 15.72,41.48 16.99,42.75 16.99,46.56 14.45,49.1 10.64,49.1 6.83,52.91 6.83,79.58 | 32.23,113.87 35.41,117.04 43.03,117.04 43.66,116.41 SIGN_CON.6
  Top 0.305: 32.23,113.87 32.23,104.98 6.83,79.58
M4_A
  Bottom 1.524: MOT_4.1 37.31,82.12 | 43.66,75.77 MOTOR_DRIVER_4.OUTA3 | 37.31,78.31 38.58,77.04 MOTOR_DRIVER_4.OUTA2 MOTOR_DRIVER_4.OUTA 39.85,74.5 38.58,75.77
  Bottom 3.302: 37.31,82.12 37.31,78.31 39.85,75.77 43.66,75.77
M4_B
  Bottom 1.524: 43.66,70.69 MOTOR_DRIVER_4.OUTB3 | MOT_4.2 32.23,82.12 | 34.77,71.96 MOTOR_DRIVER_4.OUTB1 MOTOR_DRIVER_4.OUTB 36.04,69.42 34.77,70.69
  Bottom 3.302: 32.23,82.12 32.23,74.5 34.77,71.96 36.04,70.69 43.66,70.69
M4_INA
  Top 0.254: SIGN_CON.3 41.12,106.25
  Top 0.305: 41.12,106.25 16.35,81.49 16.35,78.31 15.09,77.04 MOTOR_DRIVER_4.INA
M4_INB
  Top 0.254: SIGN_CON.5 43.66,104.98 28.45,89.76 28.45,66.91 25.88,64.34 MOTOR_DRIVER_4.INB
M4_PWM
  Top 0.254: MOTOR_DRIVER_4.PWM 10.64,71.96 9.37,73.23 9.37,77.04 38.58,106.25 SIGN_CON.1
N$1  (via drill 0.35)
  Top 1.27: 13.18,13.79 14.45,15.06 14.45,16.08 v15.09,16.72 v18.9,16.72 v16.99,16.72
  Top 2.54: 18.01,13.79 23.29,13.79 S_MOTORI.1
  Top 3.302: BAT_+.1 13.18,13.79 18.01,13.79
  Bottom 1.27: S_ELETTR..1 91.72,13.54 88.11,13.54 86.84,14.81 86.84,21.16 81.76,26.24 61.44,26.24 55.09,19.89 39.22,19.89 36.04,16.72 v15.09,16.72
N$2
  Top 0.254: R4.2 LED2.A
N$3
  Top 0.254: R3.2 LED1.A
N$6
  Bottom 0.508: 71.09,3.38 71.09,3.46 72.03,4.4 72.87,3.56 72.87,3.38
  Bottom 0.813: 51.28,4.65 L1.P$2
  Bottom 1.016: IC1.2 72.03,7.39
  Bottom 1.27: 51.28,4.65 51.28,3.38 71.09,3.38 72.23,3.38 | D1.1 72.87,3.38 72.23,3.38 | 72.03,7.39 72.03,4.4 72.03,3.58 72.23,3.38
N$7
  Bottom 0.254: 62.33,7.19 67.79,7.19 68.63,8.03 IC1.4 | 62.33,7.19 62.2,7.19 | 62.2,7.19 62.08,7.19 | 62.08,7.19 60.17,7.19 59.41,7.95 R2.2 | R1.2 62.2,7.32 | 62.2,7.19 62.2,7.32 | 62.08,7.19 62.2,7.32 | 62.2,7.32 62.33,7.19
S1_IN
  Bottom 0.254: SIGN_CON.20 63.98,113.87 71.47,121.36 102.21,121.36 105.89,117.68 105.89,112.6 104.89,111.6 S1.2
S1_OUT
  Bottom 0.254: S1.3 103.08,113.87 100.81,113.87 94.46,120.22 72.87,120.22 63.98,111.33 SIGN_CON.19
S2_IN
  Bottom 0.254: SIGN_CON.17 58.9,110.06 61.44,107.52 75.41,107.52 90.65,92.28 97,92.28 99.54,94.82 99.54,101.17 100.81,102.44 104.62,102.44 105.89,101.17 105.89,97.36 104.89,96.36 S2.2
S2_OUT
  Bottom 0.254: SIGN_CON.15 56.36,110.06 60.17,106.25 74.14,106.25 89.38,91.01 98.27,91.01 100.81,93.55 100.81,97.36 101.81,98.36 S2.3
S3_IN
  Bottom 0.254: SIGN_CON.13 53.82,110.06 58.9,104.98 72.87,104.98 90.02,87.84 100.81,87.84 103.35,87.84 104.62,87.84 105.89,86.56 105.89,82.12 104.89,81.12 S3.2
S3_OUT
  Bottom 0.254: SIGN_CON.11 51.28,110.06 57.63,103.71 71.6,103.71 92.19,83.12 102.08,83.12 S3.3
S4_IN
  Bottom 0.254: SIGN_CON.9 48.74,110.06 56.36,102.44 70.97,102.44 99.22,74.18 102.4,74.18 104.62,71.96 104.62,66.88 103.62,65.88 S4.2
S4_OUT
  Bottom 0.254: SIGN_CON.7 46.2,110.06 55.09,101.17 70.33,101.17 98.27,73.23 98.27,69.42 99.81,67.88 S4.3
VCC
  Bottom 0.305: 83.54,9.98 84.3,10.75 85.06,9.98 | 79.22,9.73 79.22,10.11 79.86,10.75 80.49,10.11 80.49,9.73
  Bottom 0.406: 83.54,9.98 83.54,9.73 83.54,9.48 84.3,8.71 85.06,9.48 85.06,9.73 85.06,9.98
  Bottom 0.813: C4.1 84.3,8.71 84.3,9.73 84.3,10.75 C1.1 | C3.+ 79.86,10.75 79.86,9.73
  Bottom 1.27: S_ELETTR..2 85.06,9.73 84.3,9.73 83.54,9.73 80.49,9.73 79.86,9.73 79.22,9.73 73.81,9.73 IC1.1
VMOT
  Top 0.508: 27.78,9.73 27.78,9.48 29.69,7.57 30.45,8.33 30.45,8.46
  Top 1.016: 42.39,47.32 44.93,49.86 | 44.68,31.32 43.41,32.34 | 44.68,28.78 43.41,27.76
  Top 1.27: C2.1 29.69,7.57 29.69,9.73
  Top 1.524: MOTOR_DRIVER_2.VIN2 84.3,30.05 | 81.76,30.05 83.03,28.78 MOTOR_DRIVER_2.VIN0 MOTOR_DRIVER_2.VIN1 83.03,31.32 84.3,30.05 | 84.3,30.05 84.3,30.56 82.52,32.34 | 81.76,47.83 79.47,50.12 79.47,50.37 79.47,50.75 81,52.28 | 84.3,60.53 MOTOR_DRIVER_1.VIN2 | 83.03,61.8 81.76,60.53 | 84.3,61.8 MOTOR_DRIVER_1.VIN1 MOTOR_DRIVER_1.VIN0 | 84.3,61.8 83.03,61.8 | MOTOR_DRIVER_1.VIN0 83.67,59.26 | 83.67,59.26 83.03,59.26 83.03,61.8 | MOTOR_DRIVER_1.VIN0 86.84,59.26 84.3,61.8 | 81.76,57.74 82.14,57.74 83.67,59.26 | MOTOR_DRIVER_4.VIN2 44.93,60.53 | 43.66,60.53 44.93,61.8 MOTOR_DRIVER_4.VIN1 MOTOR_DRIVER_4.VIN0 43.66,59.26 42.39,57.99 | 42.39,52.66 42.9,52.66 45.18,50.37 | MOTOR_DRIVER_3.VIN1 44.68,31.32 43.66,31.32 42.39,30.05 43.66,28.78 44.68,28.78 MOTOR_DRIVER_3.VIN0 MOTOR_DRIVER_3.VIN1
  Top 1.778: MOTOR_DRIVER_3.VIN2 42.39,30.05
  Top 2.54: S_MOTORI.2 27.78,9.73
  Top 3.302: 27.78,9.73 29.69,9.73 32.23,9.73 34.77,12.27 34.77,16.08 42.39,23.7 42.39,30.05 42.39,47.32 42.39,50.37 | 42.39,50.37 45.18,50.37 79.47,50.37 81.76,50.37 | 84.3,30.05 83.03,30.05 81.76,31.32 81.76,47.83 81.76,50.37 | 84.3,60.53 83.03,60.53 81.76,59.26 81.76,57.74 81.76,50.37 | 44.93,60.53 42.39,57.99 42.39,52.66 42.39,50.37

### Text on the board
tNames: LS_NORD | LS_EST | LS_SUD | LS_OVEST | 5V | 5V/S